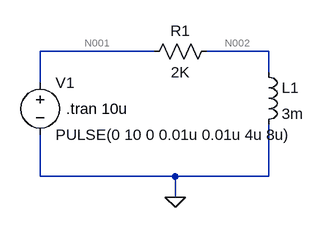
[diagram p0: schematic 2.3lab.asc]
2.3lab.asc, the LTspice schematic file:
Version 4
SHEET 1 880 680
WIRE 144 64 -32 64
WIRE 320 64 224 64
WIRE 320 96 320 64
WIRE -32 112 -32 64
WIRE -32 256 -32 192
WIRE 176 256 -32 256
WIRE 320 256 320 176
WIRE 320 256 176 256
WIRE 176 288 176 256
FLAG 176 288 0
SYMBOL res 240 48 R90
WINDOW 0 0 56 VBottom 2
WINDOW 3 32 56 VTop 2
SYMATTR InstName R1
SYMATTR Value 2K
SYMBOL ind 304 80 R0
SYMATTR InstName L1
SYMATTR Value 3m
SYMBOL voltage -32 96 R0
WINDOW 123 0 0 Left 0
WINDOW 39 0 0 Left 0
SYMATTR InstName V1
SYMATTR Value PULSE(0 10 0 0.01u 0.01u 4u 8u)
TEXT 8 152 Left 2 !.tran 10u

The netlist it stands for:
* 2.3lab.asc
R1 N002 N001 2K
L1 N002 0 3m
V1 N001 0 PULSE(0 10 0 0.01u 0.01u 4u 8u)
.tran 10u
.backanno
.end

* Results of the author's LTspice run, read from the files saved beside the schematic
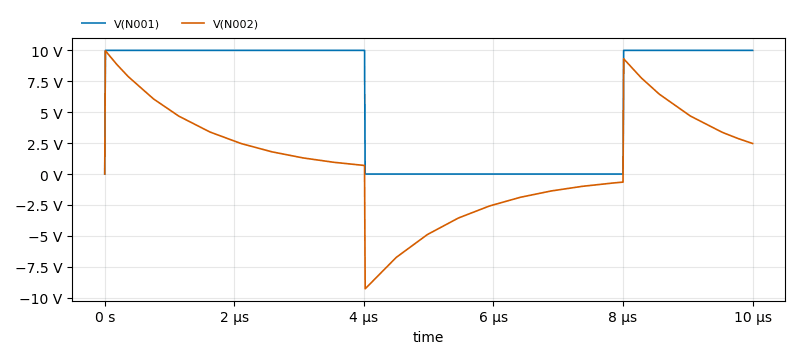
[diagram p1: Transient Analysis of 2.3lab.asc, plotted from the saved traces]
* Transient Analysis, 1 run:
*   V(N001): min 0 V, max 10 V, average 6.005 V, rms 7.747 V, last 10 V
*   V(N002): min -9.279 V, max 9.967 V, average 1.132 V, rms 4.523 V, last 2.473 V